# EAGLE design afe_revB (EAGLE 6.4)
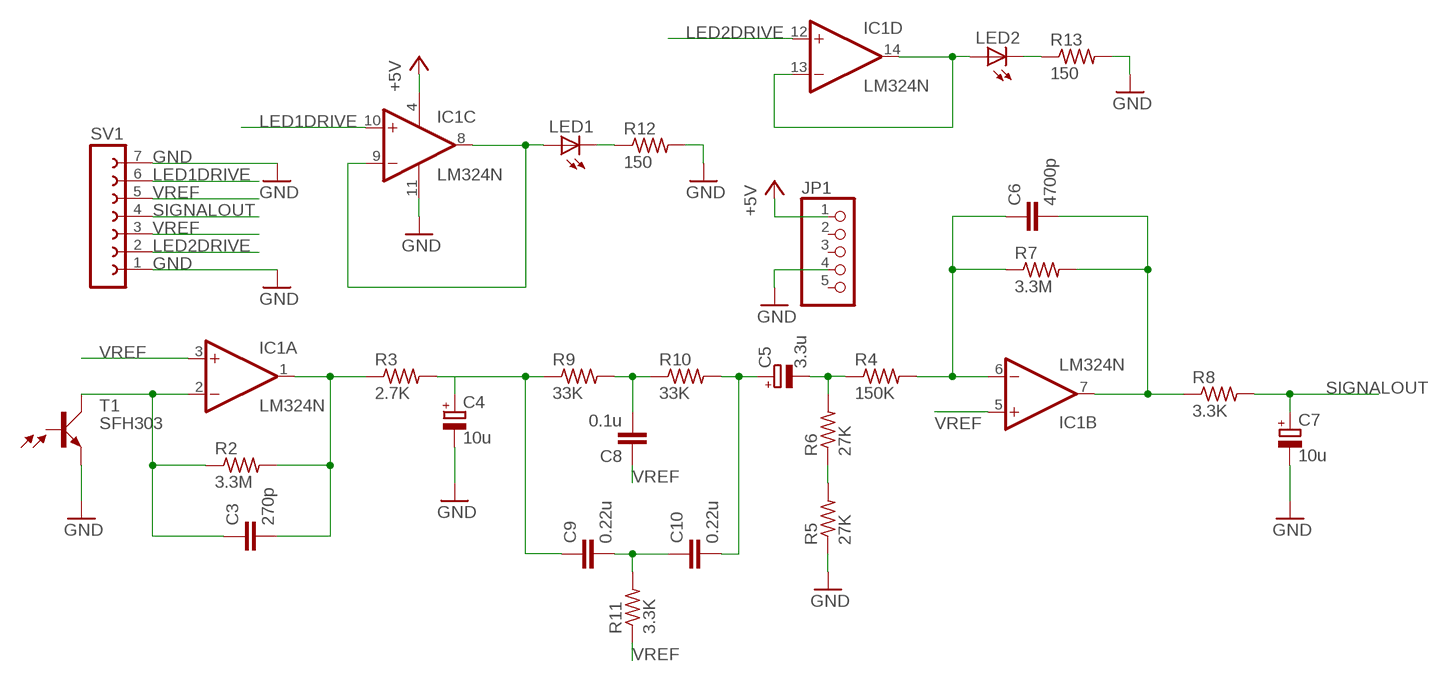
[diagram p0: schematic, sheet 1]

## Parts
C3  270p  C-EU050-024X044  [C050-024X044]
C4  10u  CPOL-EUE2.5-5  [E2,5-5]
C5  3.3u  CPOL-EUE2.5-5  [E2,5-5]
C6  4700p  C-EU050-024X044  [C050-024X044]
C7  10u  CPOL-EUE2.5-5  [E2,5-5]
C8  0.1u  C-EU050-024X044  [C050-024X044]
C9  0.22u  C-EU102-043X133  [C102-043X133]
C10  0.22u  C-EU102-043X133  [C102-043X133]
IC1  LM324N  [DIL14]
JP1  PINHD-1X5  [1X05]
LED1  LED5MM  [LED5MM]
LED2  LED5MM  [LED5MM]
R2  3.3M  R-US_0207/10  [0207/10]
R3  2.7K  R-US_0207/10  [0207/10]
R4  150K  R-US_0207/10  [0207/10]
R5  27K  R-US_0207/10  [0207/10]
R6  27K  R-US_0207/10  [0207/10]
R7  3.3M  R-US_0207/10  [0207/10]
R8  3.3K  R-US_0207/10  [0207/10]
R9  33K  R-US_0207/10  [0207/10]
R10  33K  R-US_0207/10  [0207/10]
R11  3.3K  R-US_0207/10  [0207/10]
R12  150  R-US_0207/10  [0207/10]
R13  150  R-US_0207/10  [0207/10]
SV1  FE07-1  [FE07]
T1  SFH303  [SFH303]

## Nets
+5V: IC1.4(P:V+) JP1.1
GND: C4.- C7.- IC1.11(P:V-) JP1.4 R5.1 R12.2 R13.2 SV1.1 SV1.7 T1.1(E)
LED1DRIVE: IC1.10(C:+IN) SV1.6
LED2DRIVE: IC1.12(D:+IN) SV1.2
N$1: C3.2 IC1.1(A:OUT) R2.2 R3.1
N$2: C3.1 IC1.2(A:-IN) R2.1 T1.2(C)
N$3: C4.+ C9.1 R3.2 R9.1
N$4: C5.- R4.1 R6.2
N$5: R5.2 R6.1
N$6: C6.1 IC1.6(B:-IN) R4.2 R7.1
N$7: C6.2 IC1.7(B:OUT) R7.2 R8.1
N$8: C8.2 R9.2 R10.1
N$9: C5.+ C10.2 R10.2
N$10: C9.2 C10.1 R11.2
N$11: IC1.13(D:-IN) IC1.14(D:OUT) LED2.A
N$12: IC1.8(C:OUT) IC1.9(C:-IN) LED1.A
N$13: LED1.K(C) R12.1
N$14: LED2.K(C) R13.1
SIGNALOUT: C7.+ R8.2 SV1.4
VREF: C8.1 IC1.3(A:+IN) IC1.5(B:+IN) R11.1 SV1.3 SV1.5
Unconnected: JP1.2 JP1.3 JP1.5 T1.3(B)

## Library data of the parts
C3 C6 C8-C10 = rcl:C-EU: CAPACITOR, European symbol
C4 C5 C7 = rcl:CPOL-EU: POLARIZED CAPACITOR, European symbol
IC1 = linear:LM324: OP AMP
JP1 = pinhead:PINHD-1X5: PIN HEADER
LED1 LED2 = led:LED: LED OSRAM: - CHIPLED LG R971, LG N971, LY N971, LG Q971, LY Q971, LO R971, LY R971 LH N974, LH R974 LS Q976, LO Q976, LY Q976 LO Q996 - Hyper CHIPLED LW Q18S LB Q993, LB Q99A, LB R99A - SideLED LS A670, LO A670, LY A670, LG A670, LP A670 LB A673, LV A673, LT A673, LW A673 LH A674 LY A675 LS A676, LA A676, LO A676, LY A676, LW A676 LS A679, LY A679, LG A679 - Hyper Micro SIDELED® LS Y876, LA Y876, LO Y876, LY Y876 LT Y87S - SmartLED LW L88C, LW L88S LB L89C, LB L89S, LG L890 LS L89K, LO L89K, LY L89K LS L896, LA L896, LO L896, LY L896 - TOPLED LS T670, LO T670, LY T670, LG T670, LP T670 LSG T670, LSP T670, LSY T670, LOP T670, LYG T670 LG T671, LOG T671, LSG T671 LB T673, LV T673, LT T673, LW T673 LH T674 LS T676, LA T676, LO T676, LY T676, LB T676, LH T676, LSB T676, LW T676 LB T67C, LV T67C, LT T67C, LS T67K, LO T67K, LY T67K, LW E67C LS E67B, LA E67B, LO E67B, LY E67B, LB E67C, LV E67C, LT E67C LW T67C LS T679, LY T679, LG T679 LS T770, LO T770, LY T770, LG T770, LP T770 LB T773, LV T773, LT T773, LW T773 LH T774 LS E675, LA E675, LY E675, LS T675 LS T776, LA T776, LO T776, LY T776, LB T776 LHGB T686 LT T68C, LB T68C - Hyper Mini TOPLED® LB M676 - Mini TOPLED Santana® LG M470 LS M47K, LO M47K, LY M47K Source: http://www.osram.convergy.de LUXEON: - LUMILED® LXK2-PW12-R00, LXK2-PW12-S00, LXK2-PW14-U00, LXK2-PW14-V00 LXK2-PM12-R00, LXK2-PM12-S00, LXK2-PM14-U00 LXK2-PE12-Q00, LXK2-PE12-R00, LXK2-PE12-S00, LXK2-PE14-T00, LXK2-PE14-U00 LXK2-PB12-K00, LXK2-PB12-L00, LXK2-PB12-M00, LXK2-PB14-N00, LXK2-PB14-P00, LXK2-PB14-Q00 LXK2-PR12-L00, LXK2-PR12-M00, LXK2-PR14-Q00, LXK2-PR14-R00 LXK2-PD12-Q00, LXK2-PD12-R00, LXK2-PD12-S00 LXK2-PH12-R00, LXK2-PH12-S00 LXK2-PL12-P00, LXK2-PL12-Q00, LXK2-PL12-R00 Source: www.luxeon.com KINGBRIGHT: KA-3528ASYC Source: www.kingbright.com
R2-R13 = rcl:R-US_: RESISTOR, American symbol
SV1 = con-lsta:FE07-1: FEMALE HEADER; OC_FARNELL: unknown; OC_NEWARK: unknown
T1 = opto-trans-siemens:SFH303: Silicium NPN Phototransistor Source: Siemens; OC_FARNELL: unknown; OC_NEWARK: unknown

## Board
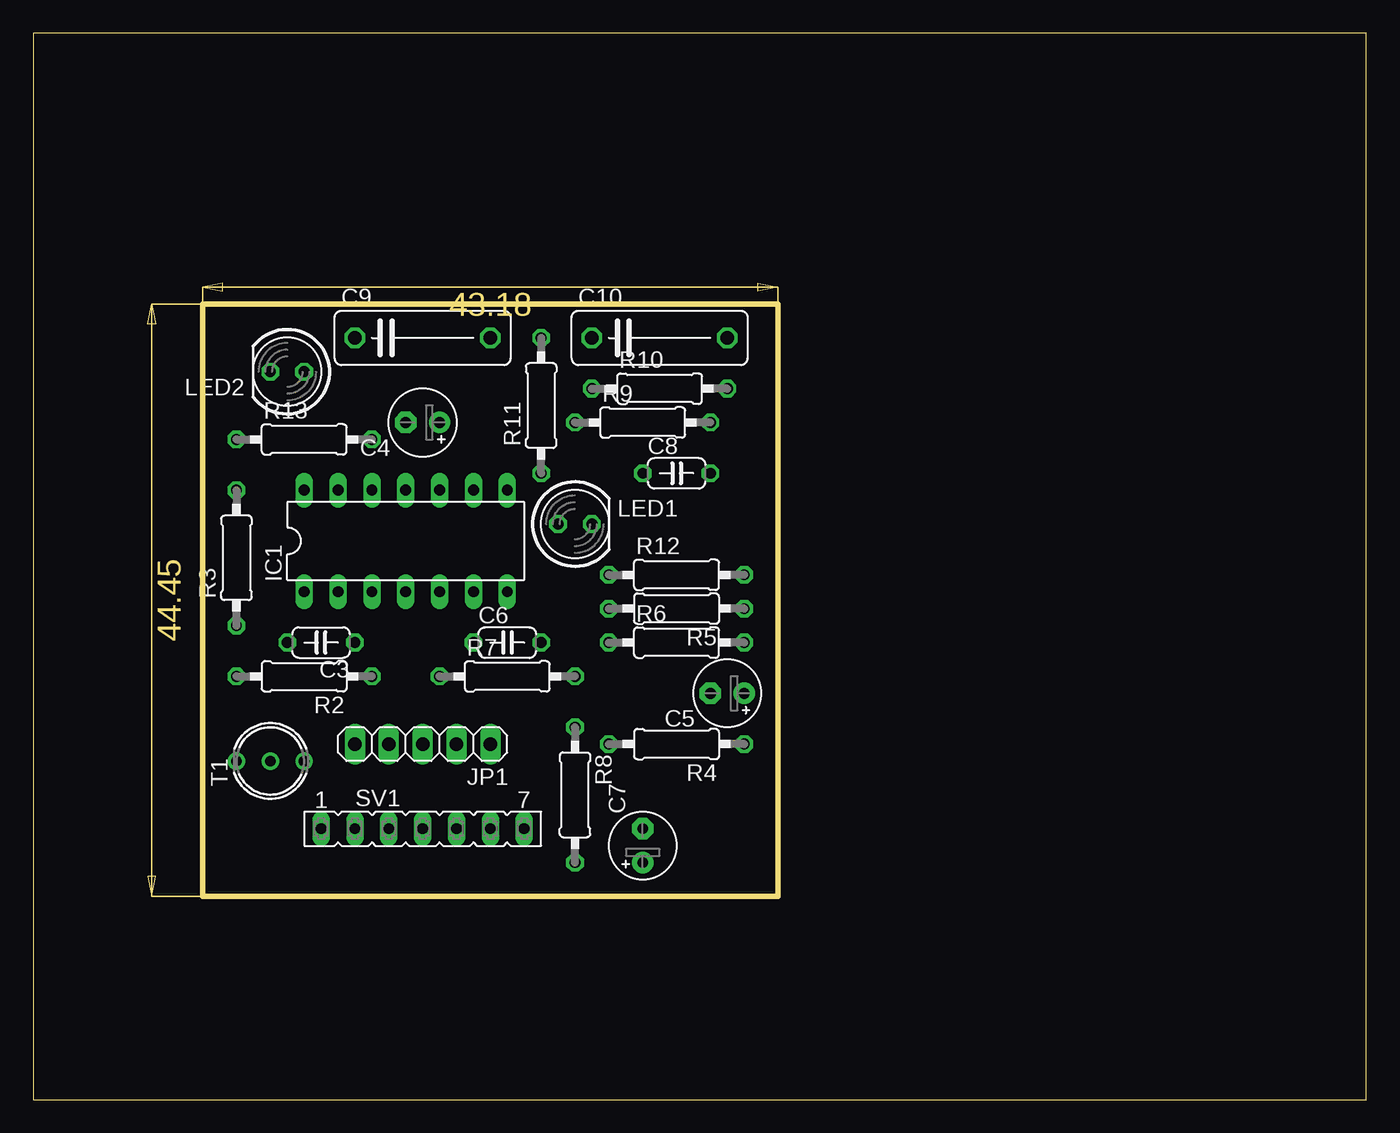
[diagram p1: board, top side]
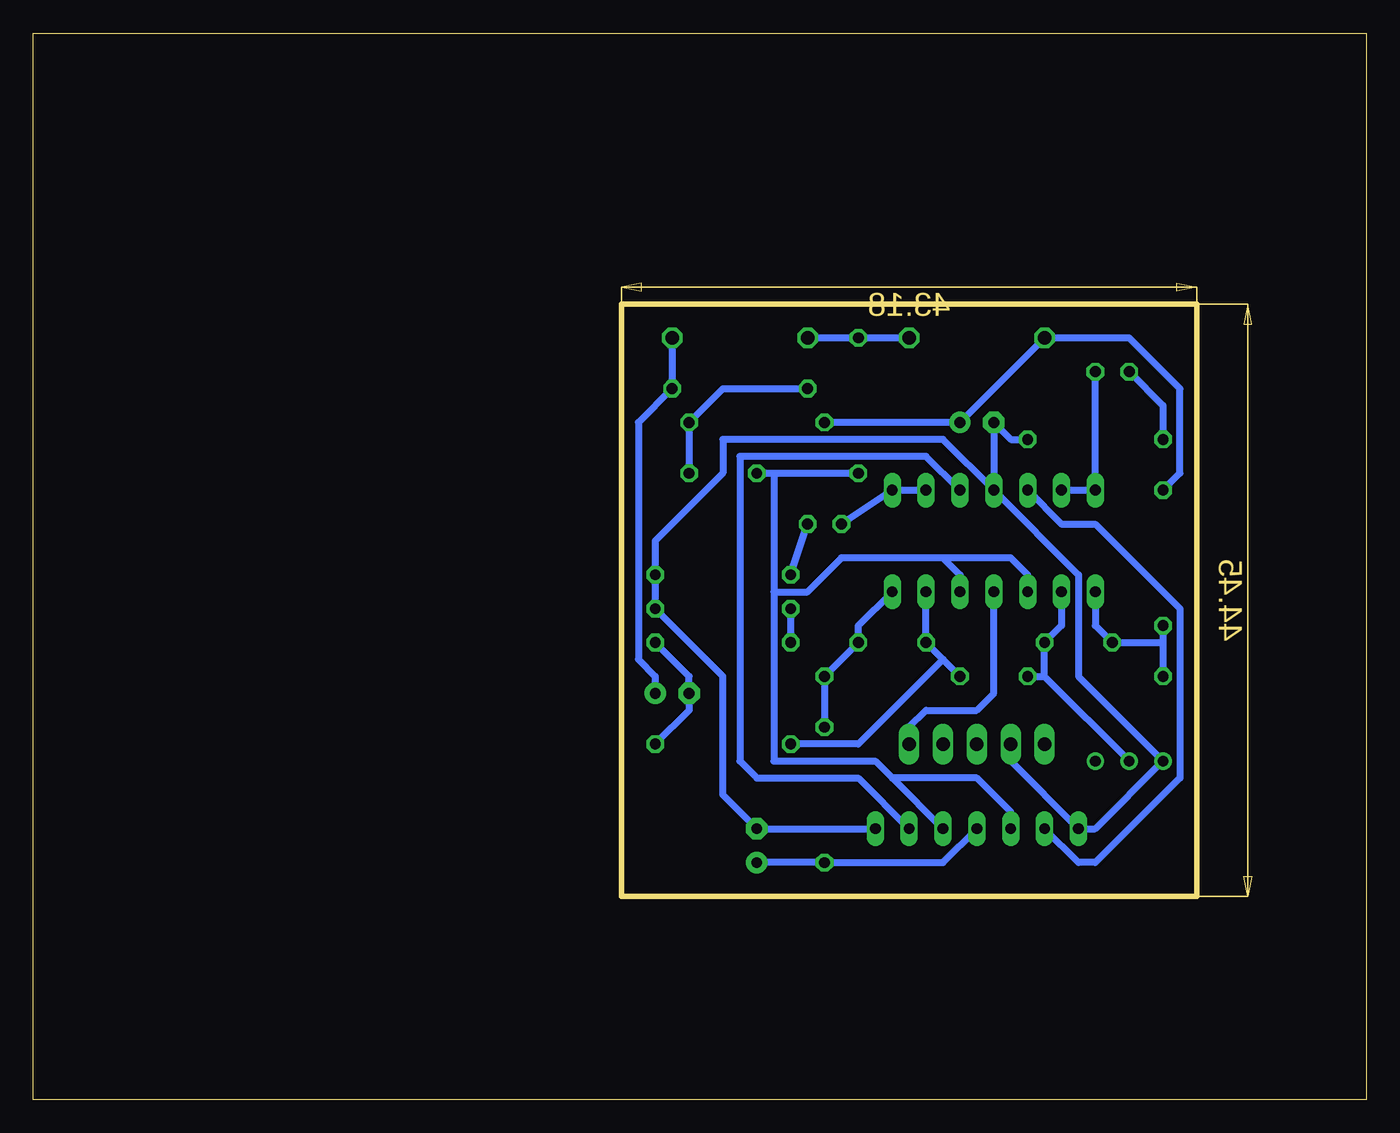
[diagram p2: board, bottom side, seen from below]

Size 100 x 80 mm. Coordinates in mm from the lower left corner, seen from the top.
Outline: 0,0 100,0 100,80 0,80 0,0
Outline: 12.7,15.24 55.88,15.24 55.88,59.69 12.7,59.69 12.7,15.24
Copper layers (1*16): Top 0.035mm / dielectric 1.5mm / Bottom 0.035mm
Design rules "default *": minimum track width 20mil, minimum drill 24mil, track to track 16mil, track to pad 12mil, pad to pad 8mil, via to via 8mil, smd to smd 8mil, copper to edge 40mil, drill to drill 8mil, minimum pad ring 10mil, minimum via ring 8mil, stop-mask expansion 4mil, vias tented up to drill 0mil, thermal gap 10mil

### Footprints (pad centres in the part's own frame; a part is rotated, then mirrored left to right if it is on the bottom)
C050-024X044 = drill 0.813 octagon: 1 -2.54,0; 2 2.54,0
E2,5-5 = drill 0.813 pad 1.6: + -1.27,0 | drill 0.813 pad 1.6 octagon: - 1.27,0
C102-043X133 = drill 1.016 octagon: 1 -5.08,0; 2 5.08,0
DIL14 = drill 0.813 long: 1 -7.62,-3.81; 2 -5.08,-3.81; 3 -2.54,-3.81; 4 0,-3.81; 5 2.54,-3.81; 6 5.08,-3.81; 7 7.62,-3.81; 8 7.62,3.81; 9 5.08,3.81; 10 2.54,3.81; 11 0,3.81; 12 -2.54,3.81; 13 -5.08,3.81; 14 -7.62,3.81
1X05 = drill 1.016 long: 1 -5.08,0; 2 -2.54,0; 3 0,0; 4 2.54,0; 5 5.08,0
LED5MM = drill 0.813 octagon: A -1.27,0; K 1.27,0
0207/10 = drill 0.813 octagon: 1 -5.08,0; 2 5.08,0
FE07 = drill 0.813 long: 1 -7.62,0; 2 -5.08,0; 3 -2.54,0; 4 0,0; 5 2.54,0; 6 5.08,0; 7 7.62,0
SFH303 = drill 0.8 pad 1.3: 1 0,2.54; 2 0,0; 3 0,-2.54

### Placement (x,y rotation side)
C3  21.59,34.29 180 top
C4  29.21,50.8 180 top
C5  52.07,30.48 180 top
C6  35.56,34.29 0 top
C7  45.72,19.05 90 top
C8  48.26,46.99 0 top
C9  29.21,57.15 0 top
C10  46.99,57.15 0 top
IC1  27.94,41.91 0 top
JP1  29.21,26.67 180 top
LED1  40.64,43.18 0 top
LED2  19.05,54.61 180 top
R2  20.32,31.75 180 top
R3  15.24,40.64 90 top
R4  48.26,26.67 180 top
R5  48.26,36.83 180 top
R6  48.26,34.29 0 top
R7  35.56,31.75 0 top
R8  40.64,22.86 270 top
R9  45.72,50.8 0 top
R10  46.99,53.34 0 top
R11  38.1,52.07 90 top
R12  48.26,39.37 0 top
R13  20.32,49.53 0 top
SV1  29.21,20.32 0 top
T1  17.78,25.4 90 top

### Tracks (layer width: path | path; a pad name or v marks a point on that pad's centre or on a via)
+5V
  Bottom 0.508: IC1.4 27.94,30.48 29.21,29.21 33.02,29.21 34.29,27.94 JP1.1
GND
  Bottom 0.508: JP1.4 26.67,25.4 SV1.1 20.32,20.32 T1.1 21.59,31.75 21.59,39.37 IC1.11 | SV1.7 C7.- 48.26,22.86 48.26,31.75 R5.1 R12.2 53.34,41.91 48.26,46.99 48.26,49.53 31.75,49.53 IC1.11 | R13.2 26.67,49.53 C4.- IC1.11
LED1DRIVE
  Bottom 0.508: SV1.6 38.1,24.13 45.72,24.13 46.99,25.4 46.99,48.26 33.02,48.26 IC1.10
LED2DRIVE
  Bottom 0.508: SV1.2 21.59,17.78 20.32,17.78 13.97,24.13 13.97,36.83 20.32,43.18 22.86,43.18 IC1.12
N$1
  Bottom 0.508: R3.1 15.24,34.29 | 15.24,34.29 R2.2 | IC1.1 20.32,35.56 C3.2 15.24,34.29
N$2
  Bottom 0.508: 24.13,31.75 T1.2 | R2.1 24.13,31.75 | 24.13,31.75 C3.1 22.86,35.56 IC1.2
N$3
  Bottom 0.508: R9.1 C4.+ C9.1 17.78,57.15 13.97,53.34 13.97,46.99 R3.2
N$4
  Bottom 0.508: R4.1 50.8,29.21 C5.- 50.8,31.75 R6.2
N$5
  Bottom 0.508: R5.2 R6.1
N$6
  Bottom 0.508: 31.75,33.02 C6.1 IC1.6 | 31.75,33.02 R7.1 | R4.2 38.1,26.67 31.75,33.02
N$7
  Bottom 0.508: R8.1 R7.2 C6.2 38.1,35.56 IC1.7
N$8
  Bottom 0.508: C8.2 R9.2 48.26,53.34 R10.1
N$9
  Bottom 0.508: C10.2 R10.2 54.61,50.8 54.61,33.02 53.34,31.75 C5.+
N$10
  Bottom 0.508: C9.2 R11.2 C10.1
N$11
  Bottom 0.508: IC1.13 IC1.14 LED2.A
N$12
  Bottom 0.508: IC1.9 IC1.8 LED1.A
N$13
  Bottom 0.508: R12.1 LED1.K
N$14
  Bottom 0.508: R13.1 15.24,52.07 LED2.K
SIGNALOUT
  Bottom 0.508: SV1.4 31.75,17.78 R8.2 C7.+
VREF
  Bottom 0.508: C8.1 44.45,46.99 | 44.45,46.99 R11.1 | 35.56,24.13 36.83,25.4 44.45,25.4 44.45,38.1 | 35.56,24.13 SV1.5 | 44.45,46.99 44.45,38.1 | 44.45,38.1 41.91,38.1 39.37,40.64 31.75,40.64 | IC1.3 25.4,39.37 26.67,40.64 31.75,40.64 | IC1.5 30.48,39.37 31.75,40.64 | SV1.3 26.67,21.59 29.21,24.13 35.56,24.13